# EAGLE design DOUT3X (EAGLE 5.06)
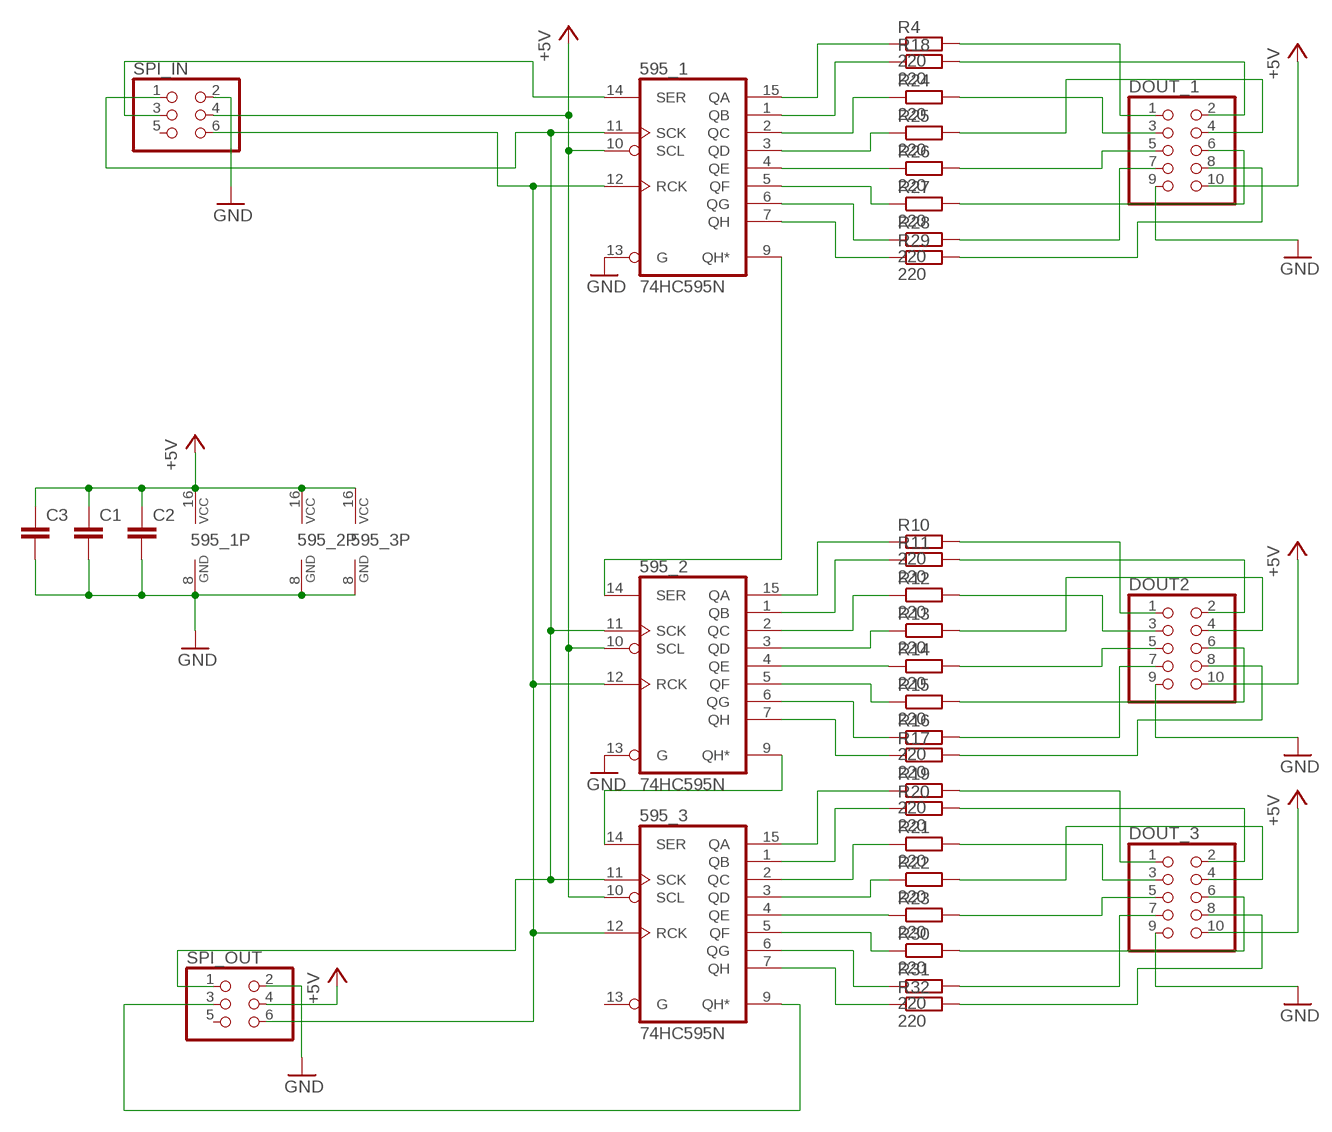
[diagram p0: schematic, sheet 1]

## Parts
595_1  74HC595N  [DIL16]
595_2  74HC595N  [DIL16]
595_3  74HC595N  [DIL16]
C1  C-EU050-024X044  [C050-024X044]
C2  C-EU050-024X044  [C050-024X044]
C3  C-EU050-024X044  [C050-024X044]
DOUT2  PINHD-2X5  [2X05]
DOUT_1  PINHD-2X5  [2X05]
DOUT_3  PINHD-2X5  [2X05]
R4  220  R-EU_0207/10  [0207/10]
R10  220  R-EU_0207/10  [0207/10]
R11  220  R-EU_0207/10  [0207/10]
R12  220  R-EU_0207/10  [0207/10]
R13  220  R-EU_0207/10  [0207/10]
R14  220  R-EU_0207/10  [0207/10]
R15  220  R-EU_0207/10  [0207/10]
R16  220  R-EU_0207/10  [0207/10]
R17  220  R-EU_0207/10  [0207/10]
R18  220  R-EU_0207/10  [0207/10]
R19  220  R-EU_0207/10  [0207/10]
R20  220  R-EU_0207/10  [0207/10]
R21  220  R-EU_0207/10  [0207/10]
R22  220  R-EU_0207/10  [0207/10]
R23  220  R-EU_0207/10  [0207/10]
R24  220  R-EU_0207/10  [0207/10]
R25  220  R-EU_0207/10  [0207/10]
R26  220  R-EU_0207/10  [0207/10]
R27  220  R-EU_0207/10  [0207/10]
R28  220  R-EU_0207/10  [0207/10]
R29  220  R-EU_0207/10  [0207/10]
R30  220  R-EU_0207/10  [0207/10]
R31  220  R-EU_0207/10  [0207/10]
R32  220  R-EU_0207/10  [0207/10]
SPI_IN  PINHD-2X3  [2X03]
SPI_OUT  PINHD-2X3  [2X03]

## Nets
+5V: 595_1.10(SCL) 595_1.16(VCC) 595_2.10(SCL) 595_2.16(VCC) 595_3.10(SCL) 595_3.16(VCC) C1.1 C2.1 C3.1 DOUT2.10 DOUT_1.10 DOUT_3.10 SPI_IN.4 SPI_OUT.4
GND: 595_1.8(GND) 595_1.13(G) 595_2.8(GND) 595_2.13(G) 595_3.8(GND) C1.2 C2.2 C3.2 DOUT2.9 DOUT_1.9 DOUT_3.9 SPI_IN.2 SPI_OUT.2
N$1: 595_2.9(QH*) 595_3.14(SER)
N$14: DOUT_1.1 R4.2
N$17: DOUT_1.2 R18.2
N$18: 595_1.9(QH*) 595_2.14(SER)
N$21: 595_1.12(RCK) 595_2.12(RCK) 595_3.12(RCK) SPI_IN.6 SPI_OUT.6
N$23: 595_2.15(QA) R10.1
N$24: 595_1.15(QA) R4.1
N$25: 595_2.1(QB) R11.1
N$26: 595_2.2(QC) R12.1
N$27: 595_2.3(QD) R13.1
N$28: 595_2.4(QE) R14.1
N$29: 595_2.5(QF) R15.1
N$30: 595_2.6(QG) R16.1
N$31: 595_2.7(QH) R17.1
N$32: DOUT2.1 R10.2
N$33: DOUT2.2 R11.2
N$34: DOUT2.3 R12.2
N$35: DOUT2.4 R13.2
N$36: 595_1.1(QB) R18.1
N$37: 595_1.2(QC) R24.1
N$38: 595_1.3(QD) R25.1
N$39: 595_1.4(QE) R26.1
N$40: 595_1.5(QF) R27.1
N$41: 595_1.6(QG) R28.1
N$42: 595_1.7(QH) R29.1
N$43: DOUT2.5 R14.2
N$44: DOUT2.6 R15.2
N$45: DOUT_1.3 R24.2
N$46: DOUT2.7 R16.2
N$47: DOUT_1.4 R25.2
N$48: DOUT2.8 R17.2
N$49: 595_3.15(QA) R19.1
N$50: 595_3.1(QB) R20.1
N$51: 595_3.2(QC) R21.1
N$52: 595_3.3(QD) R22.1
N$53: 595_3.4(QE) R23.1
N$54: 595_3.5(QF) R30.1
N$55: 595_3.6(QG) R31.1
N$56: 595_3.7(QH) R32.1
N$57: DOUT_3.1 R19.2
N$58: DOUT_3.2 R20.2
N$59: DOUT_3.3 R21.2
N$60: DOUT_3.4 R22.2
N$61: DOUT_3.5 R23.2
N$62: DOUT_3.6 R30.2
N$63: DOUT_3.7 R31.2
N$64: DOUT_3.8 R32.2
N$65: 595_3.9(QH*) SPI_OUT.3
N$69: DOUT_1.5 R26.2
N$74: DOUT_1.6 R27.2
N$75: DOUT_1.7 R28.2
N$76: DOUT_1.8 R29.2
N$77: 595_1.11(SCK) 595_2.11(SCK) 595_3.11(SCK) SPI_IN.1 SPI_OUT.1
N$78: 595_1.14(SER) SPI_IN.3
Unconnected: 595_3.13(G) SPI_IN.5 SPI_OUT.5

## Library data of the parts
595_1-595_3 = 74xx-eu:74*595: 8-bit SHIFT REGISTER, output latch
C1-C3 = rcl:C-EU: CAPACITOR, European symbol
DOUT2 DOUT_1 DOUT_3 = pinhead:PINHD-2X5: PIN HEADER
R4 R10-R32 = rcl:R-EU_: RESISTOR, European symbol
SPI_IN SPI_OUT = pinhead:PINHD-2X3: PIN HEADER

## Board
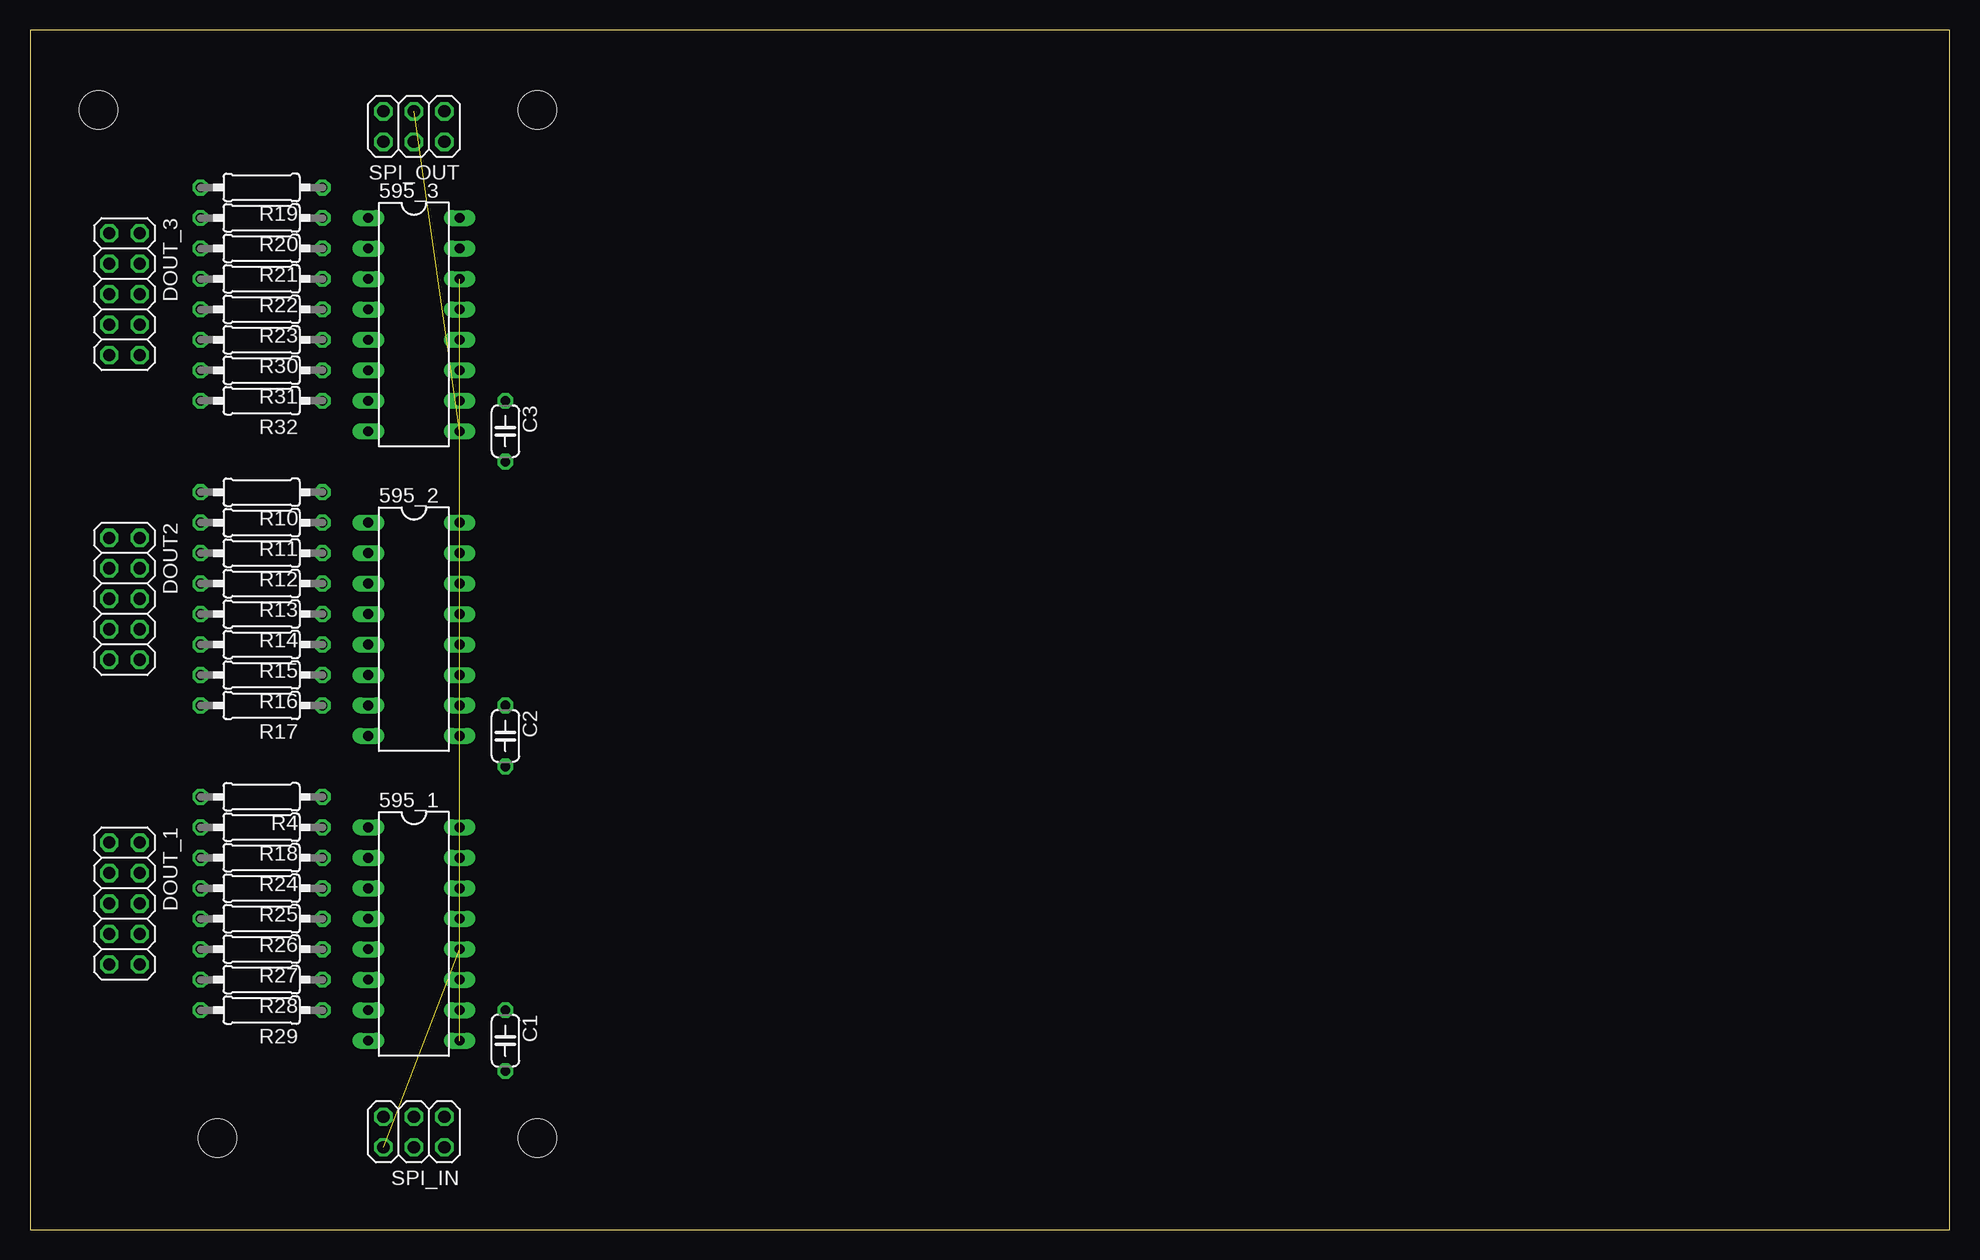
[diagram p1: board, top side]
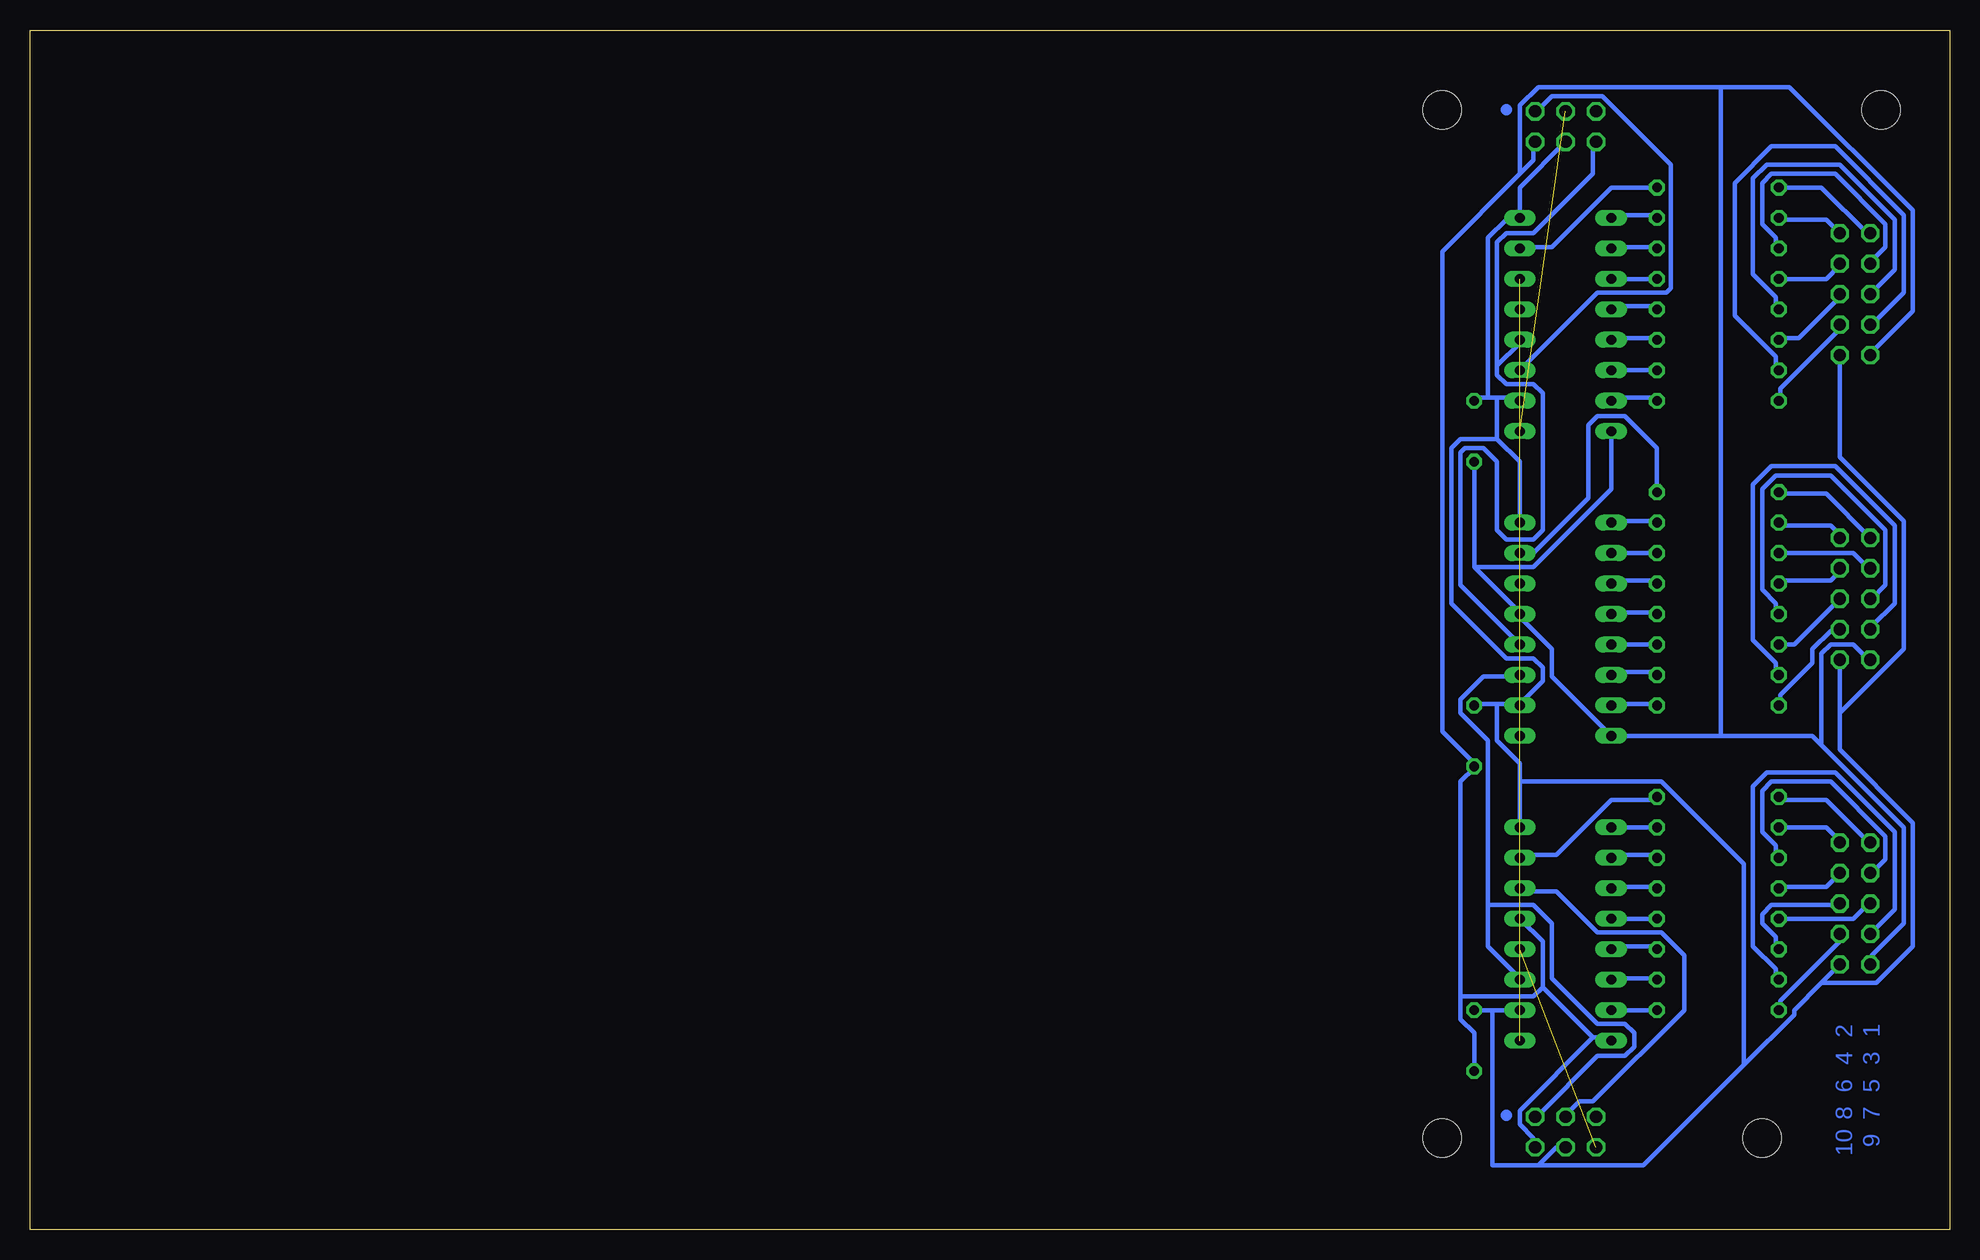
[diagram p2: board, bottom side, seen from below]

Size 160 x 100 mm. Coordinates in mm from the lower left corner, seen from the top.
Outline: 0,0 160,0 160,100 0,100 0,0
Copper layers (1*16): Top 0.018mm / dielectric 1.5mm / Bottom 0.018mm
Design rules "DRC": minimum track width 15mil, minimum drill 20mil, track to track 10mil, track to pad 10mil, pad to pad 10mil, via to via 10mil, smd to smd 8mil, copper to edge 80mil, drill to drill 20mil, minimum pad ring 10mil, minimum via ring 10mil, stop-mask expansion 4mil, vias tented up to drill 0mil, thermal gap 10mil
Holes 3.2 mm at 42.29,93.34 42.29,7.62 5.71,93.34 15.62,7.62

### Footprints (pad centres in the part's own frame; a part is rotated, then mirrored left to right if it is on the bottom)
DIL16 = drill 0.813 long: 1 -8.89,-3.81; 2 -6.35,-3.81; 3 -3.81,-3.81; 4 -1.27,-3.81; 5 1.27,-3.81; 6 3.81,-3.81; 7 6.35,-3.81; 8 8.89,-3.81; 9 8.89,3.81; 10 6.35,3.81; 11 3.81,3.81; 12 1.27,3.81; 13 -1.27,3.81; 14 -3.81,3.81; 15 -6.35,3.81; 16 -8.89,3.81
C050-024X044 = drill 0.813 octagon: 1 -2.54,0; 2 2.54,0
2X05 = drill 1.016 octagon: 1 -5.08,-1.27; 2 -5.08,1.27; 3 -2.54,-1.27; 4 -2.54,1.27; 5 0,-1.27; 6 0,1.27; 7 2.54,-1.27; 8 2.54,1.27; 9 5.08,-1.27; 10 5.08,1.27
0207/10 = drill 0.813 octagon: 1 -5.08,0; 2 5.08,0
2X03 = drill 1.016 octagon: 1 -2.54,-1.27; 2 -2.54,1.27; 3 0,-1.27; 4 0,1.27; 5 2.54,-1.27; 6 2.54,1.27

### Placement (x,y rotation side)
595_1  32,24.64 270 top
595_2  32,50.04 270 top
595_3  32,75.44 270 top
C1  39.62,15.75 270 top
C2  39.62,41.15 270 top
C3  39.62,66.55 270 top
DOUT2  7.87,52.58 270 top
DOUT_1  7.87,27.18 270 top
DOUT_3  7.87,77.98 270 top
R4  19.3,36.07 180 top
R10  19.3,61.47 180 top
R11  19.3,58.93 180 top
R12  19.3,56.39 180 top
R13  19.3,53.85 180 top
R14  19.3,51.31 180 top
R15  19.3,48.77 180 top
R16  19.3,46.23 180 top
R17  19.3,43.69 180 top
R18  19.3,33.53 180 top
R19  19.3,86.87 180 top
R20  19.3,84.33 180 top
R21  19.3,81.79 180 top
R22  19.3,79.25 180 top
R23  19.3,76.71 180 top
R24  19.3,30.99 180 top
R25  19.3,28.45 180 top
R26  19.3,25.91 180 top
R27  19.3,23.37 180 top
R28  19.3,20.83 180 top
R29  19.3,18.29 180 top
R30  19.3,74.17 180 top
R31  19.3,71.63 180 top
R32  19.3,69.09 180 top
SPI_IN  32,8.13 180 top
SPI_OUT  32,91.95 180 top

### Tracks (layer width: path | path; a pad name or v marks a point on that pad's centre or on a via)
+5V
  Bottom 0.381: SPI_OUT.4 35.81,86.87 595_3.16 35.81,84.2 36.96,84.2 38.48,82.68 38.48,69.34 | 37.72,69.34 35.81,69.34 595_3.10 | 37.72,69.34 38.48,69.34 | 38.48,69.34 39.62,69.34 C3.1 | 37.72,65.91 35.81,64.01 595_2.16 | 37.72,65.91 37.72,69.34 | 37.72,43.81 35.81,43.81 | 37.72,43.81 39.62,43.81 C2.1 | 35.81,37.34 35.81,38.86 37.72,40.77 37.72,43.81 | 35.81,37.34 595_1.16 | 38.1,18.29 595_1.10 | 38.1,18.29 C1.1 | SPI_IN.4 32.77,6.86 34.29,5.33 | 34.29,5.33 38.1,5.33 38.1,18.29 | 10.67,20.57 12.95,18.29 12.95,17.91 17.14,13.72 | 10.67,20.57 DOUT_1.10 | 17.14,13.72 25.53,5.33 34.29,5.33 | 9.14,43.05 9.14,40.01 3.05,33.91 3.05,23.62 6.1,20.57 10.67,20.57 | 9.14,43.05 DOUT2.10 | 9.14,43.05 3.81,48.39 3.81,59.05 9.14,64.39 DOUT_3.10 | 35.81,37.34 24,37.34 17.14,30.48 17.14,13.72 | 37.72,65.91 40.77,65.91 41.53,65.15 41.53,52.2 36.96,47.62 34.67,47.62 33.91,46.86 33.91,45.72 35.81,43.81 | 35.81,43.81 595_2.10
GND
  Bottom 0.381: 39.62,55.24 C3.2 | 39.62,55.24 35.81,51.44 595_2.13 35.81,51.05 33.15,48.39 33.15,46.1 595_2.8 19.05,41.15 | 39.62,55.24 34.67,55.24 28.19,61.72 595_3.8 | 10.67,40.39 11.43,41.15 19.05,41.15 | 10.67,40.39 3.81,33.53 3.81,25.53 6.48,22.86 6.48,22.1 DOUT_1.9 | 10.67,40.39 10.67,48.01 9.91,48.77 8,48.77 6.86,47.62 DOUT2.9 | 40.77,19.43 40.77,37.34 39.62,38.48 C2.2 39.62,38.86 42.29,41.53 42.29,81.53 35.81,88.01 | 40.77,19.43 40.77,17.53 39.62,16.38 C1.2 | 595_1.13 33.91,24 33.91,20.19 | 33.91,20.19 34.67,19.43 40.77,19.43 | 29.72,16 28.19,16 595_1.8 | 29.72,16 33.91,20.19 | 29.72,16 35.81,9.91 35.81,8.76 34.67,7.62 34.67,6.86 SPI_IN.2 | 35.81,88.01 34.67,89.15 34.67,90.68 SPI_OUT.2 | 19.05,95.25 34.29,95.25 35.81,93.73 35.81,88.01 | 19.05,95.25 13.34,95.25 3.05,84.96 3.05,76.58 6.48,73.15 DOUT_3.9 | 19.05,95.25 19.05,41.15
N$1  (1 unrouted)
N$14
  Bottom 0.381: R4.2 14.1,35.81 10.29,35.81 6.86,32.38 DOUT_1.1
N$17
  Bottom 0.381: R18.2 10.29,33.53 9.14,32.38 DOUT_1.2
N$18  (1 unrouted)
N$21  (2 unrouted)
  Bottom 0.381: 595_2.12 40.77,53.72 40.77,64.77 40.39,65.15 38.86,65.15 37.72,64.01 37.72,58.29 36.96,57.53 34.67,57.53 33.91,58.29 33.91,69.72 34.67,70.48 36.96,70.48 37.72,71.25 37.72,72.01 | 37.72,72.01 35.81,73.91 595_3.12 | 37.72,72.01 37.72,82.3 36.96,83.06 34.67,83.06 29.72,88.01 29.72,90.68 SPI_OUT.6
N$23
  Bottom 0.381: 595_2.15 34.67,56.39 30.1,60.96 30.1,67.06 29.34,67.82 27.05,67.82 24.38,65.15 R10.1
N$24
  Bottom 0.381: 595_1.15 35.81,31.24 32.77,31.24 28.19,35.81 24.38,35.81 R4.1
N$25
  Bottom 0.381: 595_2.1 28.19,59.05 24.38,59.05 R11.1
N$26
  Bottom 0.381: 595_2.2 R12.1
N$27
  Bottom 0.381: 595_2.3 28.19,54.1 24.38,54.1 R13.1
N$28
  Bottom 0.381: 595_2.4 28.19,51.44 24.38,51.44 R14.1
N$29
  Bottom 0.381: 595_2.5 R15.1
N$30
  Bottom 0.381: 595_2.6 28.19,46.48 24.38,46.48 R16.1
N$31
  Bottom 0.381: 595_2.7 28.19,43.81 24.38,43.81 R17.1
N$32
  Bottom 0.381: R10.2 14.1,61.34 10.29,61.34 DOUT2.1
N$33
  Bottom 0.381: R11.2 14.1,58.67 9.91,58.67 9.14,57.91 DOUT2.2
N$34
  Bottom 0.381: R12.2 8,56.39 6.86,55.24 DOUT2.3
N$35
  Bottom 0.381: R13.2 14.1,54.1 9.91,54.1 9.14,54.86 DOUT2.4
N$36
  Bottom 0.381: 595_1.1 R18.1
N$37
  Bottom 0.381: 595_1.2 28.19,31.24 24.38,31.24 R24.1
N$38
  Bottom 0.381: 595_1.3 28.19,28.57 24.38,28.57 R25.1
N$39
  Bottom 0.381: 595_1.4 R26.1
N$40
  Bottom 0.381: 595_1.5 28.19,23.62 24.38,23.62 R27.1
N$41
  Bottom 0.381: 595_1.6 28.19,20.95 24.38,20.95 R28.1
N$42
  Bottom 0.381: 595_1.7 R29.1
N$43
  Bottom 0.381: R14.2 14.48,51.44 14.48,52.2 15.62,53.34 15.62,61.72 14.48,62.87 9.91,62.87 5.33,58.29 5.33,53.72 6.48,52.58 DOUT2.5
N$44
  Bottom 0.381: DOUT2.6 12.95,48.77 R15.2
N$45
  Bottom 0.381: R24.2 14.48,31.24 14.48,32 15.62,33.15 15.62,36.58 14.86,37.34 9.91,37.34 5.33,32.77 5.33,30.86 6.48,29.72 DOUT_1.3
N$46
  Bottom 0.381: R16.2 14.48,46.48 14.48,47.24 16.38,49.15 16.38,62.1 14.86,63.63 9.53,63.63 4.57,58.67 4.57,52.2 6.48,50.29 DOUT2.7
N$47
  Bottom 0.381: DOUT_1.4 10.29,28.57 14.1,28.57 R25.2
N$48
  Bottom 0.381: R17.2 14.1,43.81 14.1,44.58 11.43,47.24 11.43,48.39 9.91,49.91 9.14,49.91 DOUT2.8
N$49
  Bottom 0.381: R19.1 28.19,86.87 33.15,81.92 35.81,81.92 595_3.15
N$50
  Bottom 0.381: 595_3.1 28.19,84.58 24.38,84.58 R20.1
N$51
  Bottom 0.381: 595_3.2 28.19,81.92 24.38,81.92 R21.1
N$52
  Bottom 0.381: 595_3.3 R22.1
N$53
  Bottom 0.381: 595_3.4 28.19,76.96 24.38,76.96 R23.1
N$54
  Bottom 0.381: 595_3.5 28.19,74.3 24.38,74.3 R30.1
N$55
  Bottom 0.381: 595_3.6 R31.1
N$56
  Bottom 0.381: 595_3.7 28.19,69.34 24.38,69.34 R32.1
N$57
  Bottom 0.381: R19.2 10.67,86.87 6.86,83.06 DOUT_3.1
N$58
  Bottom 0.381: DOUT_3.2 10.29,84.2 14.1,84.2 R20.2
N$59
  Bottom 0.381: R21.2 14.48,81.92 14.48,82.68 15.62,83.82 15.62,87.25 14.86,88.01 9.53,88.01 5.33,83.82 5.33,81.92 6.48,80.77 DOUT_3.3
N$60
  Bottom 0.381: R22.2 10.29,79.25 9.14,80.39 DOUT_3.4
N$61
  Bottom 0.381: R23.2 14.48,76.96 14.48,77.72 16.38,79.63 16.38,87.63 15.24,88.77 9.14,88.77 4.57,84.2 4.57,80.01 DOUT_3.5
N$62
  Bottom 0.381: R30.2 14.1,74.3 12.57,74.3 9.14,77.72 DOUT_3.6
N$63
  Bottom 0.381: R31.2 14.48,71.63 14.48,72.77 17.91,76.2 17.91,87.25 14.86,90.3 9.53,90.3 3.81,84.58 3.81,78.11 6.48,75.44 DOUT_3.7
N$64
  Bottom 0.381: DOUT_3.8 9.14,75.06 14.1,70.1 14.1,69.34 R32.2
N$65  (1 unrouted)
N$69
  Bottom 0.381: R26.2 8,25.91 6.86,27.05 DOUT_1.5
N$74
  Bottom 0.381: R27.2 14.48,23.62 14.48,24.38 15.62,25.53 15.62,26.29 14.86,27.05 9.14,27.05 DOUT_1.6
N$75
  Bottom 0.381: R28.2 14.48,20.95 14.48,21.72 16.38,23.62 16.38,36.96 15.24,38.1 9.53,38.1 4.57,33.15 4.57,26.67 DOUT_1.7
N$76
  Bottom 0.381: R29.2 14.1,18.29 14.1,19.05 9.14,24 DOUT_1.8
N$77  (1 unrouted)
  Bottom 0.381: 38.48,27.05 38.48,40.77 40.77,43.05 40.77,44.2 38.86,46.1 35.81,46.1 595_2.11 | 38.48,27.05 38.48,23.62 35.81,20.95 595_1.11 | 38.48,27.05 34.67,27.05 33.15,25.53 33.15,20.95 29.34,17.14 27.05,17.14 26.29,16.38 26.29,15.24 27.05,14.48 29.34,14.48 34.29,9.53 SPI_IN.1 | 595_3.11 29.34,78.11 23.62,78.11 23.24,78.49 23.24,88.77 28.96,94.49 33.15,94.49 34.29,93.34 SPI_OUT.1
N$78
  Bottom 0.381: 595_1.14 35.81,28.19 32.77,28.19 29.34,24.77 24,24.77 22.1,22.86 22.1,18.29 29.72,10.67 30.86,10.67 32,9.53 SPI_IN.3
(copper drawn outside any net)
  shapes: Bottom circle x2

### Text on the board
Bottom: 1 | 2 | 3 | 4 | 5 | 6 | 7 | 8 | 9 | 10